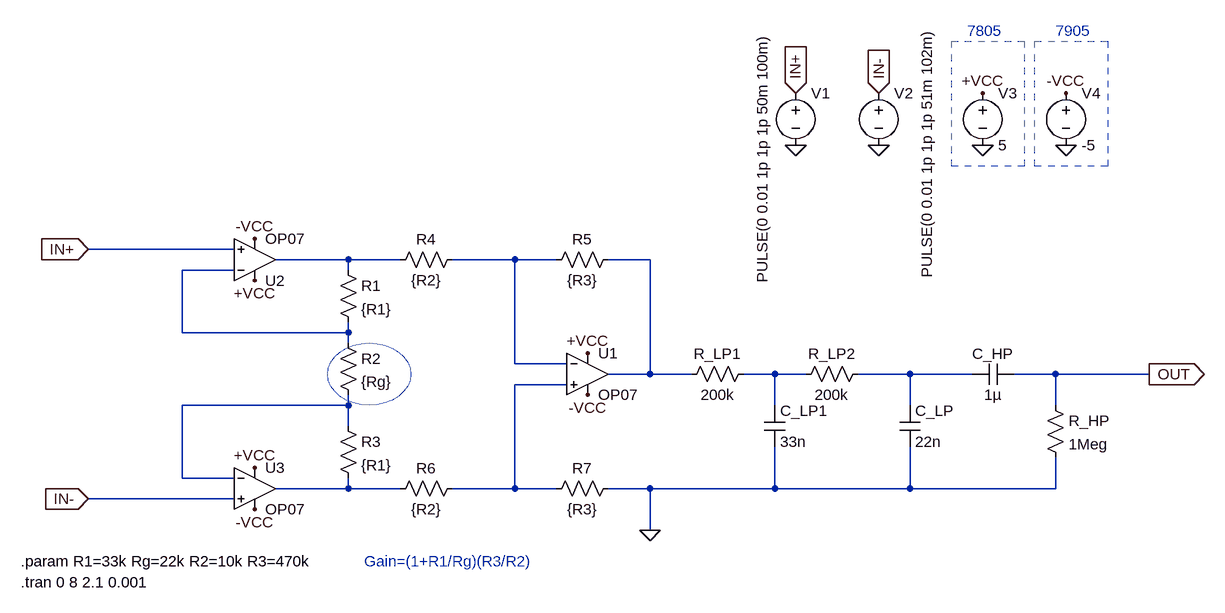
[diagram p0: schematic Instrumentation Amplifier.asc]
Instrumentation Amplifier.asc, the LTspice schematic file:
Version 4
SHEET 1 3096 680
WIRE -128 0 -352 0
WIRE 48 16 -64 16
WIRE 128 16 48 16
WIRE 304 16 208 16
WIRE 368 16 304 16
WIRE 512 16 448 16
WIRE -128 32 -208 32
WIRE 48 32 48 16
WIRE -208 128 -208 32
WIRE 48 128 48 112
WIRE 48 128 -208 128
WIRE 48 144 48 128
WIRE 304 176 304 16
WIRE 384 176 304 176
WIRE 512 192 512 16
WIRE 512 192 448 192
WIRE 576 192 512 192
WIRE 704 192 656 192
WIRE 752 192 704 192
WIRE 912 192 832 192
WIRE 1008 192 912 192
WIRE 1136 192 1072 192
WIRE 1280 192 1136 192
WIRE 384 208 304 208
WIRE 48 240 48 224
WIRE 48 240 -208 240
WIRE 704 240 704 192
WIRE 912 240 912 192
WIRE 1136 240 1136 192
WIRE 48 272 48 240
WIRE -208 352 -208 240
WIRE -128 352 -208 352
WIRE 48 368 48 352
WIRE 48 368 -64 368
WIRE 128 368 48 368
WIRE 304 368 304 208
WIRE 304 368 208 368
WIRE 368 368 304 368
WIRE 512 368 448 368
WIRE 704 368 704 304
WIRE 704 368 512 368
WIRE 912 368 912 304
WIRE 912 368 704 368
WIRE 1136 368 1136 320
WIRE 1136 368 912 368
WIRE -128 384 -352 384
WIRE 512 432 512 368
FLAG -96 48 +VCC
FLAG 416 160 +VCC
FLAG -96 336 +VCC
FLAG -96 -16 -VCC
FLAG 416 224 -VCC
FLAG -96 400 -VCC
FLAG 512 432 0
FLAG -352 0 IN+
IOPIN -352 0 In
FLAG -352 384 IN-
IOPIN -352 384 In
FLAG 1280 192 OUT
IOPIN 1280 192 Out
FLAG 736 -160 0
FLAG 864 -160 0
FLAG 736 -240 IN+
IOPIN 736 -240 In
FLAG 864 -240 IN-
IOPIN 864 -240 In
FLAG 1024 -160 0
FLAG 1024 -240 +VCC
FLAG 1152 -160 0
FLAG 1152 -240 -VCC
SYMBOL OpAmps\\OP07 416 128 R0
SYMATTR InstName U1
SYMBOL OpAmps\\OP07 -96 80 M180
SYMATTR InstName U2
SYMBOL OpAmps\\OP07 -96 304 R0
SYMATTR InstName U3
SYMBOL res 32 16 R0
SYMATTR InstName R1
SYMATTR Value {R1}
SYMBOL res 32 128 R0
SYMATTR InstName R2
SYMATTR Value {Rg}
SYMBOL res 32 256 R0
SYMATTR InstName R3
SYMATTR Value {R1}
SYMBOL res 224 0 R90
WINDOW 0 0 56 VBottom 2
WINDOW 3 32 56 VTop 2
SYMATTR InstName R4
SYMATTR Value {R2}
SYMBOL res 464 0 R90
WINDOW 0 0 56 VBottom 2
WINDOW 3 32 56 VTop 2
SYMATTR InstName R5
SYMATTR Value {R3}
SYMBOL res 224 352 R90
WINDOW 0 0 56 VBottom 2
WINDOW 3 32 56 VTop 2
SYMATTR InstName R6
SYMATTR Value {R2}
SYMBOL res 464 352 R90
WINDOW 0 0 56 VBottom 2
WINDOW 3 32 56 VTop 2
SYMATTR InstName R7
SYMATTR Value {R3}
SYMBOL voltage 736 -256 R0
WINDOW 3 -51 -77 VRight 2
WINDOW 123 0 0 Left 0
WINDOW 39 0 0 Left 0
SYMATTR Value PULSE(0 0.01 1p 1p 1p 50m 100m)
SYMATTR InstName V1
SYMBOL voltage 864 -256 R0
WINDOW 3 74 -85 VRight 2
WINDOW 123 0 0 Left 0
WINDOW 39 0 0 Left 0
SYMATTR Value PULSE(0 0.01 1p 1p 1p 51m 102m)
SYMATTR InstName V2
SYMBOL voltage 1024 -256 R0
WINDOW 123 0 0 Left 0
WINDOW 39 0 0 Left 0
SYMATTR InstName V3
SYMATTR Value 5
SYMBOL voltage 1152 -256 R0
WINDOW 123 0 0 Left 0
WINDOW 39 0 0 Left 0
SYMATTR InstName V4
SYMATTR Value -5
SYMBOL res 672 176 R90
WINDOW 0 0 56 VBottom 2
WINDOW 3 32 56 VTop 2
SYMATTR InstName R_LP1
SYMATTR Value 200k
SYMBOL res 848 176 R90
WINDOW 0 0 56 VBottom 2
WINDOW 3 32 56 VTop 2
SYMATTR InstName R_LP2
SYMATTR Value 200k
SYMBOL cap 688 240 R0
SYMATTR InstName C_LP1
SYMATTR Value 33n
SYMBOL cap 896 240 R0
SYMATTR InstName C_LP
SYMATTR Value 22n
SYMBOL cap 1072 176 R90
WINDOW 0 0 32 VBottom 2
WINDOW 3 32 32 VTop 2
SYMATTR InstName C_HP
SYMATTR Value 1µ
SYMBOL res 1120 224 R0
SYMATTR InstName R_HP
SYMATTR Value 1Meg
TEXT -456 480 Left 2 !.param R1=33k Rg=22k R2=10k R3=470k
TEXT -456 512 Left 2 !.tran 0 8 2.1 0.001
TEXT 72 480 Left 2 ;Gain=(1+R1/Rg)(R3/R2)
TEXT 1000 -336 Left 2 ;7805
TEXT 1136 -336 Left 2 ;7905
RECTANGLE Normal 1088 -128 976 -320 2
RECTANGLE Normal 1216 -128 1104 -320 2
CIRCLE Normal 144 240 16 144 2

The netlist it stands for:
* Instrumentation Amplifier.asc
XU1 N007 N002 +VCC -VCC N003 LT1001  ; OP07, pins In+ In- V+ V- OUT
XU2 IN+ N004 +VCC -VCC N001 LT1001  ; OP07, pins In+ In- V+ V- OUT
XU3 IN- N008 +VCC -VCC N009 LT1001  ; OP07, pins In+ In- V+ V- OUT
R1 N001 N004 {R1}
R2 N004 N008 {Rg}
R3 N008 N009 {R1}
R4 N002 N001 {R2}
R5 N003 N002 {R3}
R6 N007 N009 {R2}
R7 0 N007 {R3}
V1 IN+ 0 PULSE(0 0.01 1p 1p 1p 50m 100m)
V2 IN- 0 PULSE(0 0.01 1p 1p 1p 51m 102m)
V3 +VCC 0 5
V4 -VCC 0 -5
R_LP1 N005 N003 200k
R_LP2 N006 N005 200k
C_LP1 N005 0 33n
C_LP N006 0 22n
C_HP OUT N006 1µ
R_HP OUT 0 1Meg
.param R1=33k Rg=22k R2=10k R3=470k
.tran 0 8 2.1 0.001
* Gain=(1+R1/Rg)(R3/R2)
* 7805
* 7905
.lib LTC.lib
.backanno
.end

* Results of the author's LTspice run, read from the files saved beside the schematic
* Operating Point, zero values left out:
*   V(+vcc) = 5 V
*   V(-vcc) = -5 V
*   I(V4) = 6.75 mA
*   I(V3) = -6.75 mA
*   Ix(u1:3) = 2.25 mA
*   Ix(u1:4) = -2.25 mA
*   Ix(u2:3) = 2.25 mA
*   Ix(u2:4) = -2.25 mA
*   Ix(u3:3) = 2.25 mA
*   Ix(u3:4) = -2.25 mA
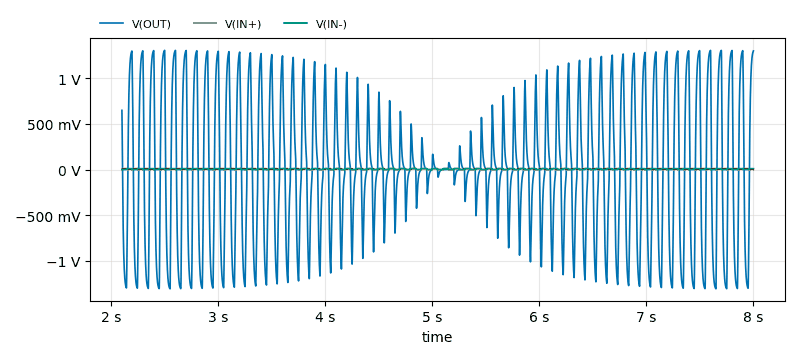
[diagram p1: Transient Analysis of Instrumentation Amplifier.asc, plotted from the saved traces]
* Transient Analysis, 1 run:
*   V(OUT): min -1.307 V, max 1.306 V, average -1.378 mV, rms 779.9 mV, last 1.3 V
*   V(IN+): min 0 V, max 10 mV, average 5 mV, rms 7.071 mV, last 0 V
*   V(IN-): min 0 V, max 10 mV, average 5 mV, rms 7.071 mV, last 10 mV